# EAGLE design MaTouch Devkit_Strip Driver V1.1 (EAGLE 6.1)
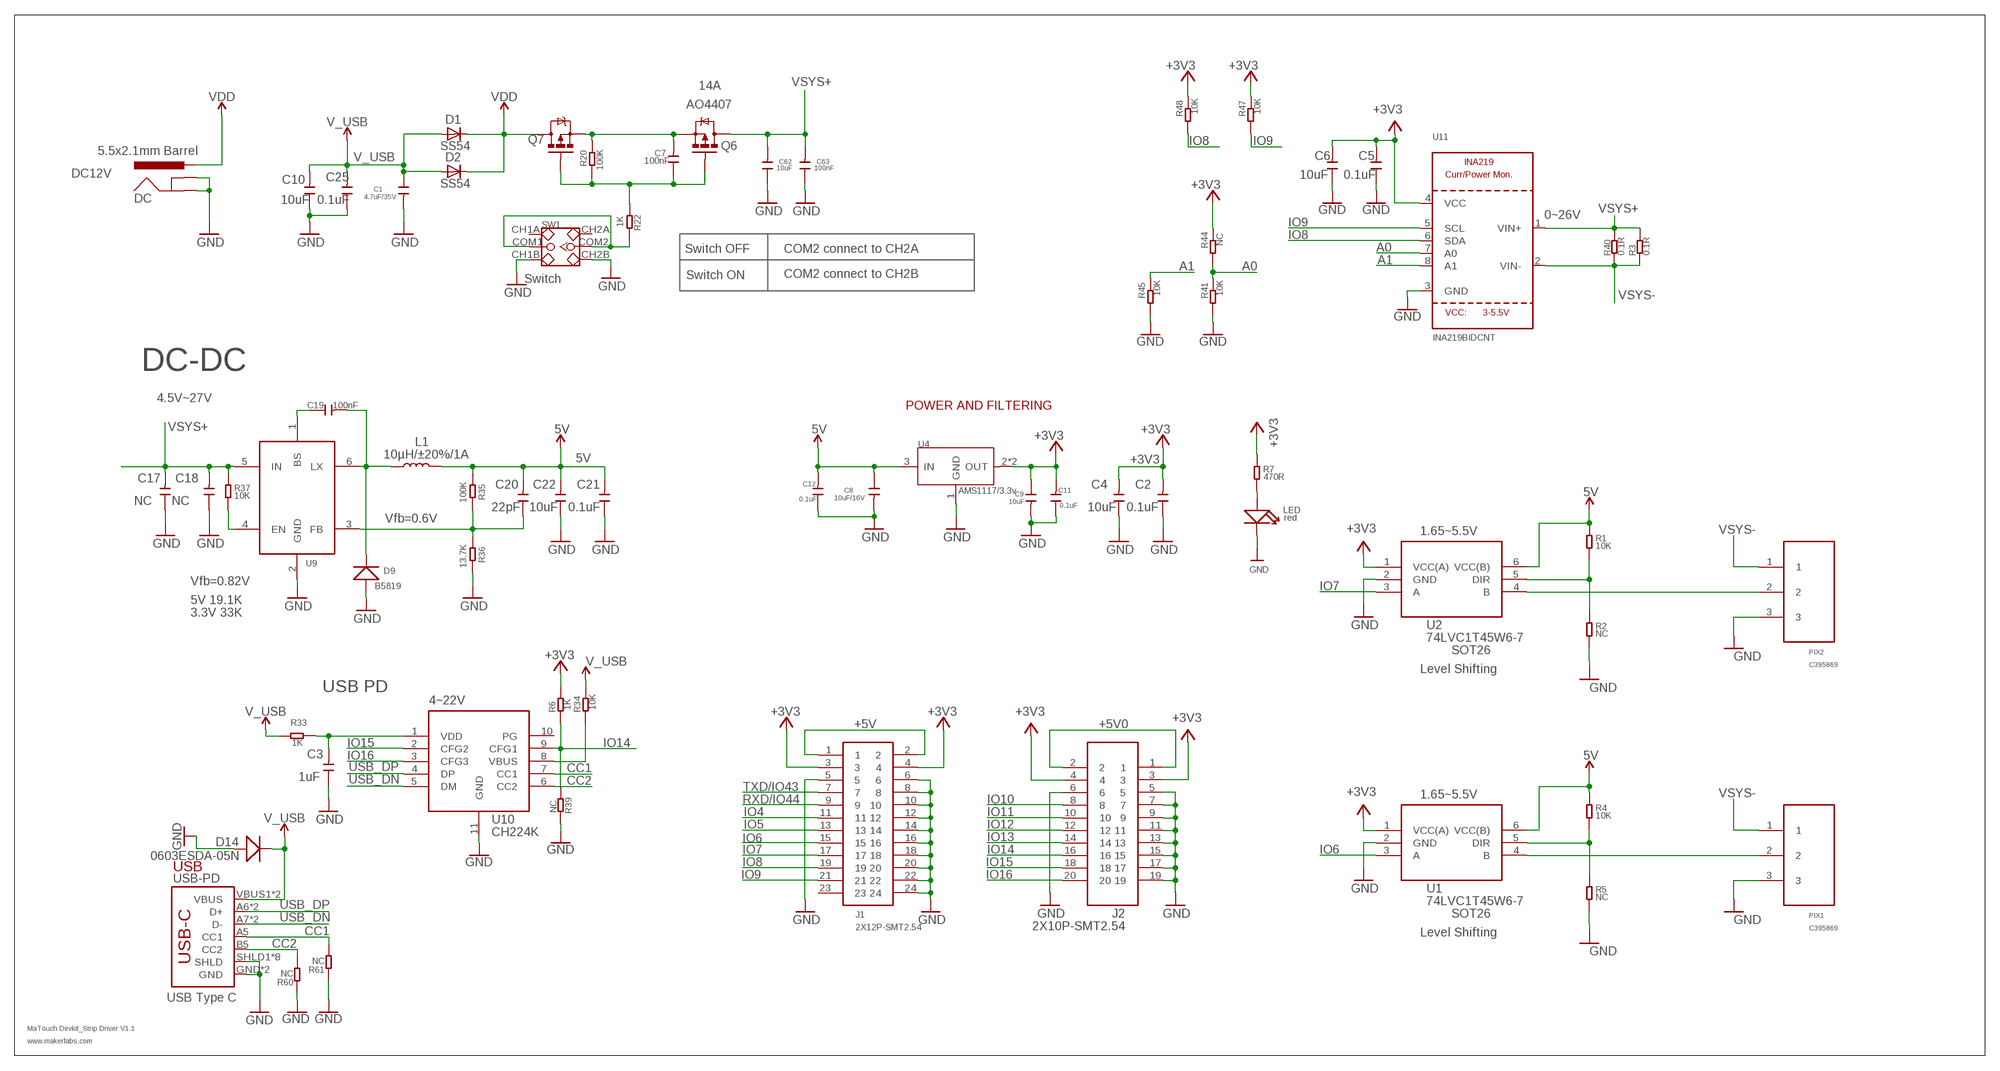
[diagram p0: schematic, sheet 1]

## Parts
C1  4.7uF/35V  C-0603  [0603]
C2  0.1uF  C-0603  [0603]
C3  1uF  C-0603  [0603]
C4  10uF  C-0603  [0603]
C5  0.1uF  C-0603  [0603]
C6  10uF  C-0603  [0603]
C7  100nF  C-0603  [0603]
C8  10uF/16V  C-0603  [0603]
C9  10uF  C-0603  [0603]
C10  10uF  C-0603  [0603]
C11  0.1uF  C-0603  [0603]
C12  0.1uF  C-0603  [0603]
C17  NC  C-0603  [0603]
C18  NC  C-0603  [0603]
C19  100nF  C-0603  [0603]
C20  22pF  C-0603  [0603]
C21  0.1uF  C-0603  [0603]
C22  10uF  C-0603  [0603]
C25  0.1uF  C-0603  [0603]
C62  10uF  C-0603  [0603]
C63  100nF  C-0603  [0603]
D1  SS54  DIODE-DO-214AC  [DO-214AC]
D2  SS54  DIODE-DO-214AC  [DO-214AC]
D9  B5819  D'1206'  [SOD123]
D14  0603ESDA-05N  DISCRETE_D0603  [DISCRETE_SOD523]
DC  5.5x2.1mm Barrel  POWER_JACKSMD  [POWER_JACK_SMD]
J1  2X12P-SMT2.54  [2X12P-SMT2.54]
J2  2X10P-SMT2.54  [2X10P-SMT2.54]
L1  10µH/±20%/1A  INDUCTOR-SRN6045-33UH  [SRN6045]
LED  red  DISCRETE_LED0603  [DISCRETE_LED-0603]
PIX1  C395869  [PIN_3P]
PIX2  C395869  [PIN_3P]
Q6  MOSFET-PCHANNELFDS6675  [SO08]
Q7  MOSFET-PCHANNELFDS6675  [SO08]
R1  10K  R-0603  [R0603]
R2  NC  R-0603  [R0603]
R3  0.1R  DISCRETE_R-2512  [DISCRETE_R2512]
R4  10K  R-0603  [R0603]
R5  NC  R-0603  [R0603]
R6  1K  R-0603  [R0603]
R7  470R  R-0603  [R0603]
R20  100K  R-0603  [R0603]
R22  1K  R-0603  [R0603]
R33  1K  R-0603  [R0603]
R34  10K  R-0603  [R0603]
R35  100K  R-0603  [R0603]
R36  13.7K  R-0603  [R0603]
R37  10K  R-0603  [R0603]
R39  NC  R-0603  [R0603]
R40  0.1R  DISCRETE_R-2512  [DISCRETE_R2512]
R41  10K  R-0603  [R0603]
R44  NC  R-0603  [R0603]
R45  10K  R-0603  [R0603]
R47  10K  R-0603  [R0603]
R48  10K  R-0603  [R0603]
R60  NC  DISCRETE_R-0603  [DISCRETE_R0603]
R61  NC  DISCRETE_R-0603  [DISCRETE_R0603]
SW1  SWITCH-2CH-6P'90D'  [6P-2CH-2.54-9.0X3.6-90D]
U1  74LVC1T45W6-7  [SOT-23-6]
U2  74LVC1T45W6-7  [SOT-23-6]
U4  AMS1117/3.3v  LD1117'SOT89'  [SOT89]
U9  SY8201ABC  [SOT-23-6]
U10  CH224K  [ESSOP-10-150MIL]
U11  INA219BIDCNT  INA219  [SOT23-8]
USB-PD  USB_C5  [USB-C-16P-5]

## Nets
5V: C8.1 C12.2 C20.2 C21.2 C22.2 L1.2 R1.1 R4.1 R35.1 U1.6(VCC(B)) U2.6(VCC(B)) U4.3(IN)
+3V3: C2.2 C4.2 C5.2 C6.2 C9.1 C11.2 J1.3 J1.4 J2.3 J2.4 R6.2 R7.1 R44.2 R47.2 R48.2 U1.1(VCC(A)) U2.1(VCC(A)) U4.2(OUT) U4.4(OUT) U11.4(VCC)
+5V: J1.1 J1.2
+5V0: J2.1 J2.2
A0: R41.2 R44.1 U11.7(A0)
A1: R45.2 U11.8(A1)
CC1: R61.2 U10.7(CC1) USB-PD.A5(CC1)
CC2: R60.2 U10.6(CC2) USB-PD.B5(CC2)
GND: C1.2 C2.1 C3.1 C4.1 C5.1 C6.1 C8.2 C9.2 C10.1 C11.1 C12.1 C17.1 C18.1 C21.1 C22.1 C25.1 C62.1 C63.1 D9.+ D14.+ DC.GND(GNDBREAK) DC.P$4(GND) J1.5 J1.6 J1.8 J1.10 J1.12 J1.14 J1.16 J1.18 J1.20 J1.22 J1.24 J2.5 J2.6 J2.7 J2.9 J2.11 J2.13 J2.15 J2.17 J2.19 LED.- PIX1.3 PIX2.3 R2.2 R5.2 R36.2 R39.2 R41.1 R45.1 R60.1 R61.1 SW1.CH1B SW1.CH2B U1.2(GND) U2.2(GND) U4.1(GND) U9.2(GND) U10.11(GND) U11.3(GND) USB-PD.GND USB-PD.GND2(GND) USB-PD.SHLD1(SHLD) USB-PD.SHLD2(SHLD) USB-PD.SHLD3(SHLD) USB-PD.SHLD4(SHLD) USB-PD.SHLD5(SHLD) USB-PD.SHLD6(SHLD) USB-PD.SHLD7(SHLD) USB-PD.SHLD8(SHLD)
IO4: J1.11
IO5: J1.13
IO6: J1.15 U1.3(A)
IO7: J1.17 U2.3(A)
IO8: J1.19 R48.1 U11.6(SDA)
IO9: J1.21 R47.1 U11.5(SCL)
IO10: J2.8
IO11: J2.10
IO12: J2.12
IO13: J2.14
IO14: J2.16 R6.1 R39.1 U10.9(CFG1)
IO15: J2.18 U10.2(CFG2)
IO16: J2.20 U10.3(CFG3)
N$2: R4.2 R5.1 U1.5(DIR)
N$3: PIX2.2 U2.4(B)
N$4: PIX1.2 U1.4(B)
N$5: LED.+ R7.2
N$9: C7.1 Q6.4(G) Q7.4(G) R20.2 R22.2
N$10: R22.1 SW1.COM1 SW1.COM2
N$41: C19.2 D9.- L1.1 U9.6(LX)
N$42: C19.1 U9.1(BS)
N$43: C20.1 R35.2 R36.1 U9.3(FB)
N$44: R37.2 U9.4(EN)
N$45: C3.2 R33.2 U10.1(VDD)
N$48: R34.1 U10.8(VBUS)
N$49: C7.2 Q6.1(S) Q6.2(S) Q6.3(S) Q7.1(S) Q7.2(S) Q7.3(S) R20.1
N$72: R1.2 R2.1 U2.5(DIR)
RXD/IO44: J1.9
TXD/IO43: J1.7
USB_DN: U10.5(DM) USB-PD.A7(D-) USB-PD.B7(D-)
USB_DP: U10.4(DP) USB-PD.A6(D+) USB-PD.B6(D+)
V_USB: C1.1 C10.2 C25.2 D1.A D2.A D14.- R33.1 R34.2 USB-PD.VBUS1(VBUS) USB-PD.VBUS2(VBUS)
VDD: D1.C D2.C DC.VIN0(PWR) Q7.5(D) Q7.6(D) Q7.7(D) Q7.8(D)
VSYS+: C17.2 C18.2 C62.2 C63.2 Q6.5(D) Q6.6(D) Q6.7(D) Q6.8(D) R3.2 R37.1 R40.2 U9.5(IN) U11.1(VIN+)
VSYS-: PIX1.1 PIX2.1 R3.1 R40.1 U11.2(VIN-)
Unconnected: J1.23 SW1.CH1A SW1.CH2A U10.10(PG)

## Notes on the sheet
- 14A
- AO4407
- DC12V
- 0~26V
- Switch OFF | COM2 connect to CH2A
- Switch ON | COM2 connect to CH2B
- Switch
- DC-DC
- 4.5V~27V
- POWER AND FILTERING
- Vfb=0.6V
- 1.65~5.5V
- Vfb=0.82V
- 5V 19.1K
- 3.3V 33K
- SOT26
- Level Shifting
- USB PD
- 4~22V
- 1.65~5.5V
- USB
- SOT26
- Level Shifting
- USB Type C
- MaTouch Devkit_Strip Driver V1.1
- www.makerfabs.com

## Library data of the parts
C1-C12 C17-C22 C25 C62 C63 = Discrete:C*: Ceramic Capacitors
D1 D2 = diode:DIODE-: DIODE
D9 = Discrete:D*
D14 = L:DISCRETE_D*
DC = SparkFun-Connectors:POWER_JACK: Power Jack Connector This is the standard 5.5mm barrel jack for power. The PTH is the most common, proven, reliable, footprint. The Slot footprint only works if the mill layer is transmitted to the PCB fab house so be warned. Here are the connectors we sell at SparkFun: DC Barrel Power Jack/Connector <https://www.sparkfun.com/products/119> (PRT-00119) DC Barrel Power Jack/Connector (SMD) <https://www.sparkfun.com/products/12748> (PRT-12748) DC Barrel Jack Adapter - Breadboard Compatible <https://www.sparkfun.com/products/10811> (PRT-10811) It is used on this SparkFun product (and many, many others): SparkFun RedBoard - Programmed with Arduino <https://www.sparkfun.com/products/12757> (DEV-12757) Also, if you need a mating power supply or connector, please check these out: Wall Adapter Power Supply - 9VDC 650mA <https://www.sparkfun.com/products/298> (TOL-00298) DC Barrel Jack Adapter - Male <https://www.sparkfun.com/products/10287> (PRT-10287); PROD_ID: CONN-08106; SF_ID: PRT-12748
J1 = sale:2X12P-SMT2.54
J2 = sale:2X10P-SMT2.54
L1 = SparkFun-Coils:INDUCTOR: Inductors Resist changes in electrical current. Basically a coil of wire. SparkFun Products: SparkFun Load Cell Amplifier - HX711 <https://www.sparkfun.com/products/13879> IOIO-OTG - V2.2 <https://www.sparkfun.com/products/13613>; PROD_ID: NDUC-11627; VALUE: 33µH/±20%/1.4A
LED = A9G:DISCRETE_LED*
PIX1 PIX2 = 1mytest:C395869
Q6 Q7 = User-Submitted:MOSFET-PCHANNEL: Generic PMOSFET IRLML2244 - TRANS-11153 (SOT-23 -20V -4.3A) (1.Gate 2.Source 3.Drain) FQP27P06 - COM-10349 <http://www.sparkfun.com/products/10349> (TO-220 -60V -27A) (1.Gate 2.Source 3.Drain)
R1 R2 R4-R7 R20 R22 R33-R37 R39 R41 R44 R45 R47 R48 = Discrete:R*
R3 R40 R60 R61 = A9G:DISCRETE_R*
SW1 = Discrete:SWITCH-2CH-6P
U1 U2 = self:74LVC1T45W6-7
U4 = IC:LD1117: Low Drop Fixed And Adjustable Positive Voltage Regulators http://www.datasheetcatalog.org/datasheet/SGSThomsonMicroelectronics/mXuqtqv.pdf
U9 = self:SY8201ABC
U10 = sale:CH224K
U11 = microbuilder:INA219: INA219 - I2C Current/Power Monitor Voltage Range: 0-26V Accuracy: 0.5% Temperature: -40°C - 125°C
USB-PD = USBC:USB_C: USB Type C 16Pin Connector Super Speed pins not available on the 16-pin purely SMD connector so this part is best for USB 2.0 implementations. D1 and D2 are tied together enabling D+/- no matter which way the cable is plugged into the connector. The two channel configuration pins (CC1/2) are exposed. These are normally connected to ground via 5.1k resistors but can be reconfigured for high current/high power applications.

## Net classes
0 default: width 0.203 mm, drill 0.305 mm, clearance 0.152 mm

## Board
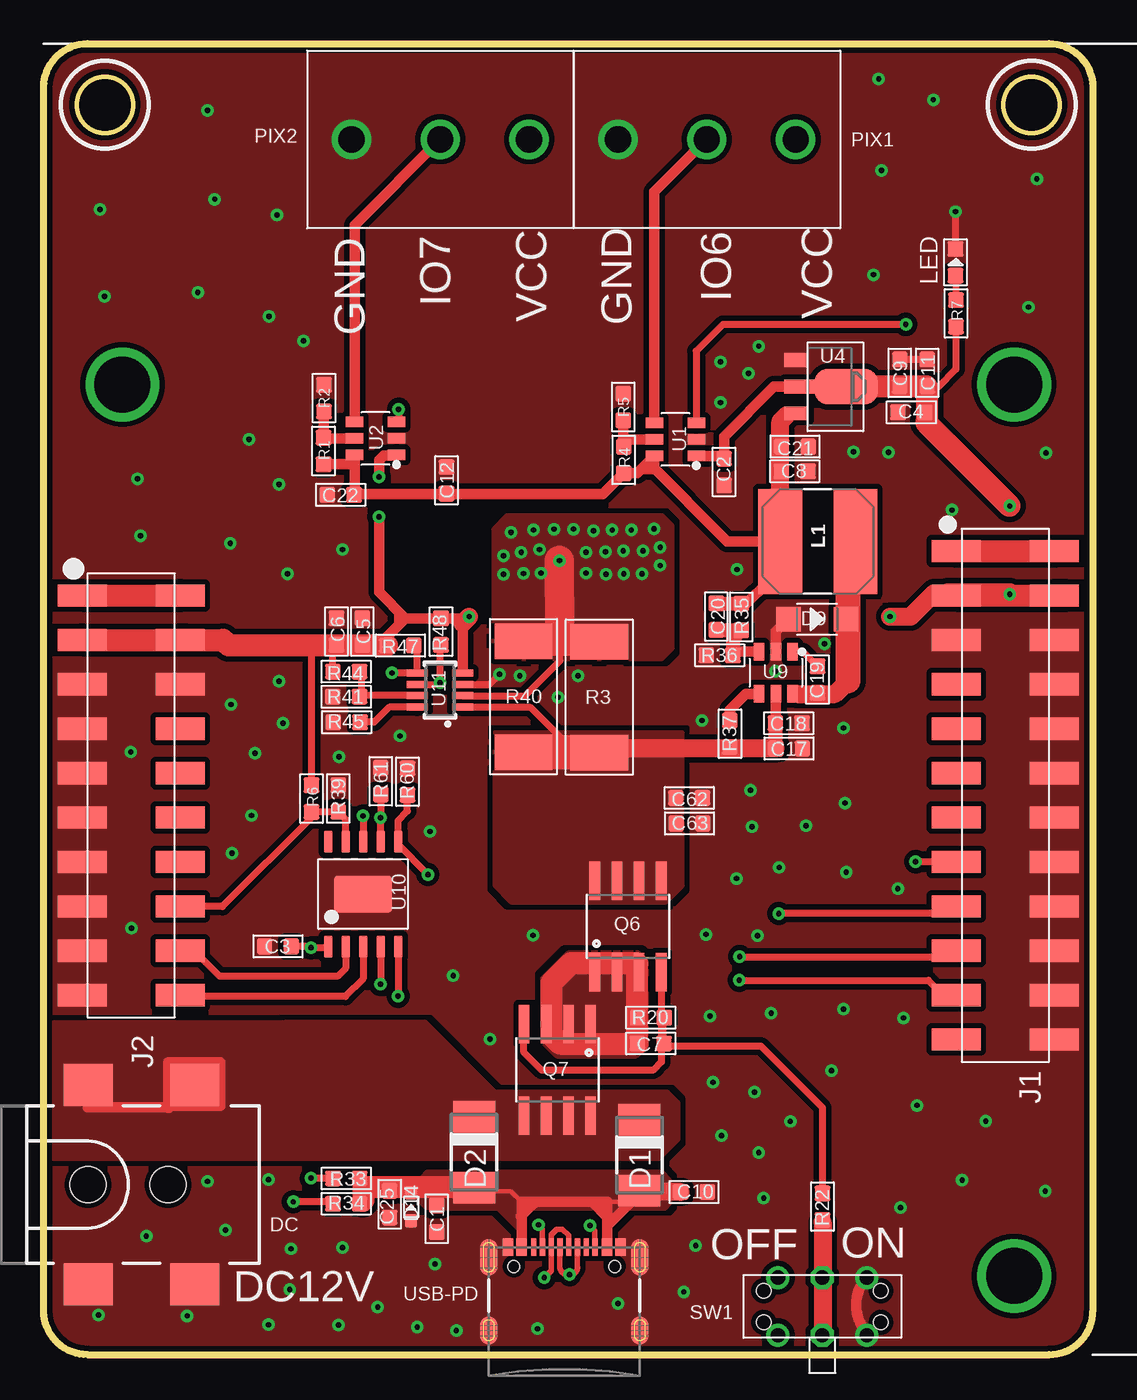
[diagram p1: board, top side]
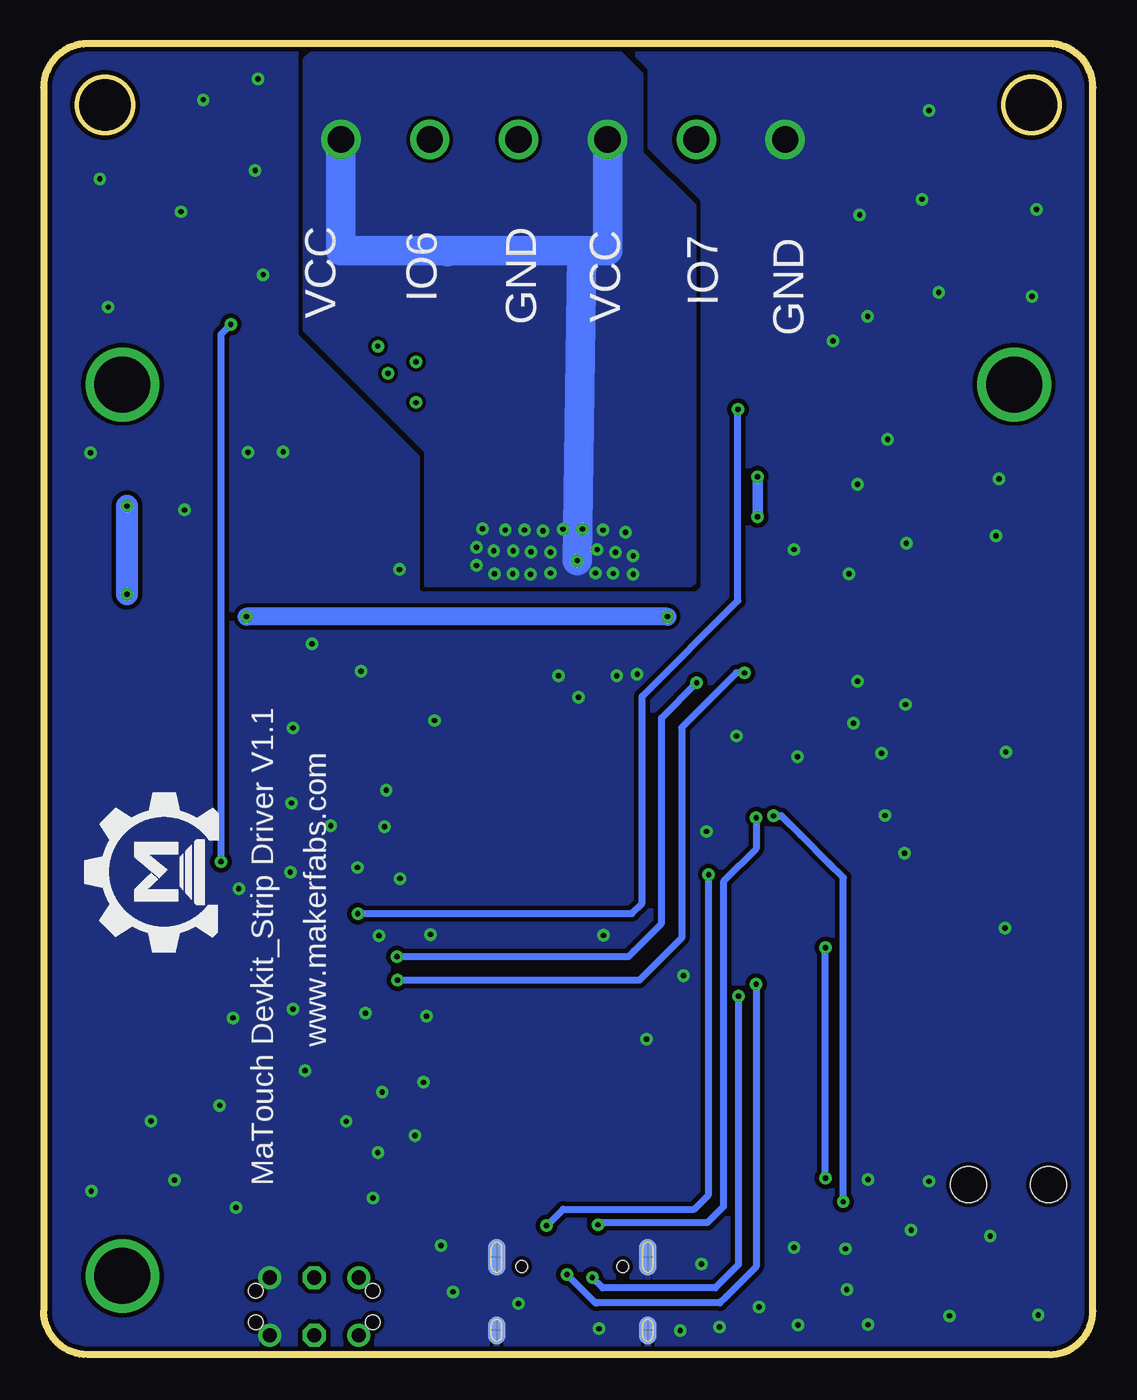
[diagram p2: board, bottom side, seen from below]

Size 60 x 75 mm. Coordinates in mm from the lower left corner, seen from the top.
Outline: 2.5,0 57.5,0 arc90 60,2.5 60,72.5 arc90 57.5,75 2.5,75 arc90 0,72.5 0,2.5 arc90 2.5,0
Outline: circle at 3.5,71.5 radius 1.6
Outline: circle at 56.5,71.5 radius 1.6
Copper layers (1*16): Top 0.035mm / dielectric 1.5mm / Bottom 0.035mm
Design rules: minimum track width 10mil, minimum drill 10mil, track to track 8mil, track to pad 8mil, pad to pad 8mil, via to via 8mil, smd to smd 0mil, copper to edge 10mil, drill to drill 8mil, minimum pad ring 10mil, minimum via ring 8mil, stop-mask expansion 4mil, vias tented up to drill 30mil, thermal gap 0mil
tRestrict: area 43.4,43.5 to 45.2,49.5

### Footprints (pad centres in the part's own frame; a part is rotated, then mirrored left to right if it is on the bottom)
0603 = smd 0.889 x 0.889: 1 -0.762,0; 2 0.762,0
DO-214AC = smd 1.8 x 2.4: A 2.025,0; C -2.025,0
SOD123 = smd 1.397 x 1.397: + -1.651,0; - 1.651,0
DISCRETE_SOD523 = smd 0.762 x 0.7: + -0.8,0; - 0.8,0
POWER_JACK_SMD = smd 2.8 x 2.4: GND 0,-5.7; P$4 6.1,-5.7; VIN0 0,5.7; VIN1 6.1,5.7 | hole 2.032: 0,0; 4.572,0
2X12P-SMT2.54 = smd 1.27 x 2.8: 1 -13.97,-2.8; 2 -13.97,2.8; 3 -11.43,-2.8; 4 -11.43,2.8; 5 -8.89,-2.8; 6 -8.89,2.8; 7 -6.35,-2.8; 8 -6.35,2.8; 9 -3.81,-2.8; 10 -3.81,2.8; 11 -1.27,-2.8; 12 -1.27,2.8; 13 1.27,-2.8; 14 1.27,2.8; 15 3.81,-2.8; 16 3.81,2.8; 17 6.35,-2.8; 18 6.35,2.8; 19 8.89,-2.8; 20 8.89,2.8; 21 11.43,-2.8; 22 11.43,2.8; 23 13.97,-2.8; 24 13.97,2.8
2X10P-SMT2.54 = smd 1.27 x 2.8: 1 -11.43,-2.8; 2 -11.43,2.8; 3 -8.89,-2.8; 4 -8.89,2.8; 5 -6.35,-2.8; 6 -6.35,2.8; 7 -3.81,-2.8; 8 -3.81,2.8; 9 -1.27,-2.8; 10 -1.27,2.8; 11 1.27,-2.8; 12 1.27,2.8; 13 3.81,-2.8; 14 3.81,2.8; 15 6.35,-2.8; 16 6.35,2.8; 17 8.89,-2.8; 18 8.89,2.8; 19 11.43,-2.8; 20 11.43,2.8
SRN6045 = smd 2.5 x 6: 1 -2.175,0; 2 2.125,0
DISCRETE_LED-0603 = smd 0.889 x 0.889: + -0.762,0; - 0.762,0
PIN_3P = drill 1.5: 1 0,10.16; 2 0,5.08; 3 0,0
SO08 = smd 0.61 x 2.21: 1 -1.905,-2.616; 2 -0.635,-2.616; 3 0.635,-2.616; 4 1.905,-2.616; 5 1.905,2.616; 6 0.635,2.616; 7 -0.635,2.616; 8 -1.905,2.616
R0603 = smd 0.889 x 0.889: 1 -0.762,0; 2 0.762,0
DISCRETE_R2512 = smd 2.032 x 3.302: 1 -3.175,0; 2 3.175,0
DISCRETE_R0603 = smd 0.889 x 0.889: 1 -0.762,0; 2 0.762,0
6P-2CH-2.54-9.0X3.6-90D = drill 0.813 pad 1.27: CH1A -2.54,-1.65; CH1B 2.54,-1.65; CH2A -2.54,1.65; CH2B 2.54,1.65 | drill 0.813 pad 1.27 octagon: COM1 0,-1.65; COM2 0,1.65 | hole 0.813: -3.35,0.9; -3.35,-0.9; 3.35,0.9; 3.35,-0.9
SOT-23-6 = smd 1 x 0.6: 1 -1.2,0.95; 2 -1.2,0; 3 -1.2,-0.95; 4 1.2,-0.95; 5 1.2,0; 6 1.2,0.95
SOT89 = smd 0.8 x 1.4: 1 -1.524,-1.905; 3 1.524,-1.905 | smd 0.8 x 1.9: 2 0,-1.651 | smd 2.032 x 3.65: 4 0,0.94
ESSOP-10-150MIL = smd 1.27 x 0.5: 1 -3,2; 2 -3,1; 3 -3,0; 4 -3,-1; 5 -3,-2; 6 3,-2; 7 3,-1; 8 3,0; 9 3,1; 10 3,2 | smd 2.1 x 3.3: 11 0,0
SOT23-8 = smd 0.4 x 1.2: 1 -0.975,-1.3; 2 -0.325,-1.3; 3 0.325,-1.3; 4 0.975,-1.3; 5 0.975,1.3; 6 0.325,1.3; 7 -0.325,1.3; 8 -0.975,1.3
USB-C-16P-5 = smd 0.3 x 1: A5 -1.25,-0.34; A6 -0.25,-0.34; A7 0.25,-0.34; A8 1.25,-0.34; B5 1.75,-0.34; B6 0.75,-0.34; B7 -0.75,-0.34; B8 -1.75,-0.34 | smd 0.6 x 1: GND -3.225,-0.34; GND2 3.225,-0.34; VBUS1 -2.45,-0.34; VBUS2 2.45,-0.34 | smd 1 x 2.1: SHLD1 -4.32,-0.915; SHLD2 4.32,-0.915 | smd 1 x 2.1 bottom: SHLD3 -4.32,-0.915; SHLD4 4.32,-0.915 | smd 1 x 1.6: SHLD5 -4.32,-5.095; SHLD8 4.32,-5.095 | smd 1 x 1.6 bottom: SHLD6 -4.32,-5.095; SHLD7 4.32,-5.095 | hole 0.65: -2.89,-1.445; 2.89,-1.445

### Placement (x,y rotation side)
C1  22.47,7.77 270 top
C2  38.91,50.5 90 top
C3  13.4,23.36 0 top
C4  49.62,53.91 0 top
C5  18.21,41.37 270 top
C6  16.74,41.37 270 top
C7  34.71,17.8 180 top
C8  42.95,50.53 0 top
C9  48.96,56.17 90 top
C10  37.19,9.31 180 top
C11  50.52,56.17 270 top
C12  23.04,50.02 270 top
C17  42.62,34.68 180 top
C18  42.6,36.13 180 top
C19  44.25,38.62 270 top
C20  38.46,42.23 90 top
C21  42.96,51.95 180 top
C22  16.98,49.19 0 top
C25  19.78,8.61 90 top
C62  36.91,31.85 180 top
C63  36.93,30.39 180 top
D1  34.06,11.42 270 top
D2  24.61,11.59 270 top
D9  44.24,42.07 0 top
D14  21.01,8.45 90 top
DC  2.54,9.73 0 top
J1  55,32 270 top
J2  5,32 270 top
L1  44.25,46.52 180 top
LED  52.15,62.5 90 top
PIX1  32.84,69.52 270 top
PIX2  17.6,69.52 270 top
Q6  33.41,24.5 0 top
Q7  29.37,16.29 180 top
R1  16,51.7 90 top
R2  16.03,54.72 90 top
R3  31.77,37.62 270 top
R4  33.17,51.19 90 top
R5  33.15,54.22 90 top
R6  15.32,31.81 90 top
R7  52.17,59.57 90 top
R20  34.73,19.28 0 top
R22  44.54,8.47 90 top
R33  17.31,10.08 180 top
R34  17.3,8.64 0 top
R35  39.89,42.2 270 top
R36  38.66,40.02 180 top
R37  39.24,35.52 90 top
R39  16.85,31.82 90 top
R40  27.44,37.64 270 top
R41  17.29,37.64 0 top
R44  17.3,39.08 180 top
R45  17.32,36.18 0 top
R47  20.4,40.58 180 top
R48  22.72,41.37 90 top
R60  20.8,32.78 270 top
R61  19.28,32.8 270 top
SW1  44.53,2.76 0 top
U1  36.12,52.36 180 top
U2  18.98,52.42 180 top
U4  44.96,55.38 270 top
U9  41.87,39.02 270 top
U10  18.26,26.35 90 top
U11  22.66,38.02 90 top
U$2  [MAKERFABS_0.3]  50.05,23.49 90 bottom
USB-PD  29.77,6.49 0 top

### Tracks (layer width: path | path; a pad name or v marks a point on that pad's centre or on a via)
5V
  Top 0.254: C12.2 23.06,49.26 23.09,49.29 23.09,49.22
  Top 0.406: 42.47,53.73 42.57,53.73 42.94,53.73 U4.3 43.07,53.85 43.08,53.86 | C8.1 42.19,51.93 42.22,51.95 C21.2 | 34.21,50.58 35.03,50.58 35.03,51.24 34.92,51.24 U1.6
  Top 0.61: C22.2 17.78,49.22 | 17.78,49.22 17.78,50.94 | 17.78,50.94 U2.6 | R1.1 17.78,50.94 | 34.56,51.05 33.94,50.43 R4.1 31.96,49.22 23.09,49.22 17.78,49.22 | 34.56,51.05 U1.6 | L1.2 41.43,46.52 | 41.43,46.52 39.09,46.52 34.56,51.05 | C21.2 42.2,53.36 42.57,53.73 | C20.2 40.21,42.99 41.4,44.18 41.4,46.49 41.43,46.52
  Top 0.813: C20.2 38.48,42.97 R35.1
  Top 1.016: L1.2 42.13,53.39 42.47,53.73
+3V3  (via drill 0.3)
  Top 0.406: 19.6,40.61 C6.2 16.54,40.4 R44.2 | 19.6,40.61 R47.2 | 19.6,40.61 C5.2 | U11.4 23.96,39.2 23.95,39.2 | R6.2 15.32,40.12 15.77,40.58 | R7.1 52.17,56.37 51.16,55.36 50.57,55.36 C11.2 | 20.22,41.59 20.22,42.45 20.55,42.12 20.68,42.12
  Top 0.61: R47.2 19.63,41.08 20.68,42.12 | 20.68,42.12 R48.2 | R48.2 23.67,42.12 23.96,41.84 23.96,41.8 23.95,41.79 23.95,39.2 | R48.2 22.79,42.13 22.81,42.15 | U1.1 38.76,51.41 C2.2 38.91,52.54 41.76,55.38 44.4,55.38 | 50.49,55.38 C11.2 | 44.4,55.38 44.58,55.38 | 44.58,55.38 45.06,55.38 | 45.06,55.38 44.58,55.38 | U4.2 44.39,55.38 44.4,55.38 | 45.06,55.38 U4.4 | C9.1 C11.2 | C11.2 50.52,53.43 50.49,53.4 50.49,53.8 C4.2 | 20.68,42.12 19.18,43.62 v19.18,47.94 | v19.18,50.23 19.18,51.17 19.46,51.45 20.19,51.45 arc253 U2.1
  Top 1.016: 23.96,41.84 23.96,41.85 v24.33,42.23 | v48.4,42.23 49.58,42.23 50.93,43.57 51.64,43.57 51.71,43.5 | 58.41,43.43 J1.4
  Top 1.27: J2.3 J2.4 | J2.4 8.07,40.89 8.08,40.88 | R47.2 15.77,40.58 10.57,40.58 10.29,40.85 10.25,40.89 J2.4 | v55.24,48.55 50.49,53.3 50.49,53.4 50.49,55.38 45.06,55.38 44.81,55.38 | v55.24,43.5 52.17,43.5 | 52.17,43.5 51.71,43.5 | 58.42,43.42 58.41,43.43 J1.4 J1.3 52.2,43.47 52.17,43.5 | 44.81,55.38 44.58,55.38 | 44.58,55.38 44.55,55.38 44.58,55.38 | 44.58,55.38 44.81,55.38
  Bottom 0.61: v19.18,47.94 v19.18,50.23
  Bottom 1.016: v24.33,42.23 v48.4,42.23
  Bottom 1.27: v55.24,48.55 v55.24,43.5
+5V
  Top 1.27: J1.1 J1.2
+5V0
  Top 0.61: 7.79,43.43 J2.2
  Top 1.27: J2.1 7.79,43.43 J2.2
A0
  Top 0.406: U11.7 18.29,37.7 18.21,37.78 18.21,37.76 18.19,37.73 | 18.19,37.73 18.19,38.87 18.01,39.05 18.03,39.05 R44.1 | R41.2 18.1,37.65 18.19,37.73
A1
  Top 0.406: U11.8 19.77,37.05 18.9,36.18 R45.2
CC1  (via drill 0.3)
  Top 0.305: 28.47,7.23 v28.3,7.43 28.3,7.4 28.52,7.17 USB-PD.A5
  Top 0.406: U10.7 19.26,30.71 v19.25,30.72 19.28,30.74 R61.2
  Bottom 0.406: v19.25,30.72 19.25,28.94 21.13,27.06 21.13,8.47 22.05,7.55 28.3,7.55 v28.3,7.43
CC2  (via drill 0.3)
  Top 0.305: USB-PD.B5 31.52,7.1 v31.24,7.38
  Top 0.406: v21.97,27.47 20.26,29.18 U10.6 20.26,30.56 20.8,31.1 R60.2
  Bottom 0.406: v31.24,7.38 30.3,8.32 22.81,8.32 21.97,9.16 v21.97,27.47
GND  (via drill 0.3)
  Top 0.406: C11.1 C9.2 | LED.- v52.15,65.39 | U11.3 25.49,38.35 v26.06,38.92 | v26.06,38.92 26.09,38.95 v26.06,38.92
  Top 0.61: U9.2 41.87,41.36 D9.+ | SW1.CH1B 46.71,1.82 arc-70 SW1.CH2B 47.04,4.38 47.12,4.43
  Top 1.016: 47.07,4.35 47.04,4.38 SW1.CH2B
  Bottom 0.406: v52.15,65.39 52.15,65.37
  other vias: 50.88,71.79 9.37,71.18 5.36,50.1 12.09,34.4 10.72,37.2 11.89,30.85 14.15,6.06 17.09,6.13 14.07,3.72 49,8.42 37.29,6.23 38.28,15.58 38.76,12.53 41.17,8.95 57.28,9.36 49.94,14.26 43.59,30.26 29.41,37.6 30.56,38.85 41.86,39.1 44.65,40.68 37.64,36.28 39.65,44.92 9.37,9.92 12.85,10.02 3.12,2.27 5.87,6.79 10.39,7.12 8.2,2.22 19.1,2.73 23.6,1.38 28.24,1.48 32.84,2.93 36.6,3.59 40.89,57.69 38.71,56.81 38.71,54.47 40.31,56.15 46.3,51.65 48.31,51.62 57.33,51.6 13.94,44.66 3.23,65.52 3.48,60.54 9.78,66.1 12.88,59.4 11.73,52.36 8.81,60.77 10.67,46.42 13.46,38.52 13.69,36.13 10.77,28.69 5.03,24.4 4.98,34.48 20.37,35.39 16.89,34.2 22.1,29.93 39.62,27.24 40.41,32.29 42.06,27.88 40.51,30.21 45.75,35.85 45.82,31.56 45.9,27.6 48.84,26.66 40.82,23.96 27.99,23.99 37.87,24.04 38.1,19.37 41.61,19.54 49.17,19.26 45.06,16.24 45.75,19.77 40.64,15.02 42.7,13.35 40.89,11.57 52.53,9.99 12.85,1.71 16.87,1.69 21.36,1.59 22.38,5.19 23.42,21.68 25.53,18.05 53.87,13.37 51.94,48.32 56.31,59.93 56.79,67.27 47.9,67.75 47.75,72.99 47.45,61.78 13.34,65.21 5.54,46.85 17.09,46.06 13.46,49.8 14.86,58 27.23,38.85
  pour Bottom (isolate 0.254, rank 4): -1.2,-15.8 -1.2,85 80,85 80,-15.8
  pour Top (isolate 0.305, rank 4, no thermals): -0.6,-15.8 -0.6,85 80,85 80,-15.8
IO6  (via drill 0.3)
  Top 0.406: J1.15 49.88,28.19 v49.86,28.2 | v49.3,58.94 38.84,58.94 37.31,57.42 U1.3 37.29,53.28 37.34,53.28
  Top 0.61: U1.3
  Bottom 0.406: v49.86,28.2 49.86,58.38 v49.3,58.94
IO7  (via drill 0.3)
  Top 0.406: J1.17 51.45,25.65 51.03,25.23 v42.04,25.23 | v20.3,54.09 20.3,53.49 U2.3
  Bottom 0.406: v42.04,25.23 26.36,25.23 25.78,25.82 25.78,37.65 20.3,43.14 v20.3,54.09
IO8  (via drill 0.3)
  Top 0.406: U11.6 22.57,38.35 v22.66,38.44 | v22.66,38.44 22.68,38.47 | 22.68,38.47 22.68,40.57 R48.1 | v22.66,38.44 22.66,38.47 22.68,38.47 | v39.8,22.77 51.94,22.77 arc90 52.22,23.05 arc-90 52.2,23.07 J1.19
  Bottom 0.406: v22.66,38.44 24.66,36.44 24.66,24.67 26.24,23.1 26.57,22.77 v39.8,22.77
IO9  (via drill 0.3)
  Top 0.406: R47.1 21.36,40.37 U11.5 v19.91,39 | v19.91,39 | v39.78,21.42 50.6,21.42 51.46,20.56 J1.21
  Bottom 0.406: v19.91,39 20.4,39 23.52,35.88 23.52,23.84 25.6,21.75 25.93,21.42 v39.78,21.42
IO14
  Top 0.406: J2.16 10.21,25.64 15.32,30.74 R6.1 | U10.9 17.26,30.63 R39.1 16.87,31.05 15.82,31.05 | 15.82,31.05 15.54,31.05 | 15.54,31.05 15.37,31.05 R6.1 | R6.1 15.54,31.05 | R39.1 15.83,31.06 15.82,31.05
IO15
  Top 0.406: U10.2 17.26,22.1 16.82,21.65 10.06,21.65 8.59,23.12 7.82,23.12 J2.18
IO16
  Top 0.406: U10.3 18.26,21.5 17.25,20.48 7.82,20.48 7.77,20.53 J2.20
N$2
  Top 0.61: R5.1 33.15,52.46 | 33.15,52.46 33.15,51.98 R4.2 | U1.5 33.25,52.36 arc-90 33.15,52.46
N$3
  Top 0.61: U2.4 arc-90 U2.4 17.77,64.62 PIX2.2
N$4
  Top 0.61: U1.4 34.92,66.52 PIX1.2
N$5
  Top 0.406: LED.+ 52.15,60.36 R7.2
N$6  (via drill 3.2)
  other vias: 55.5,4.5
N$7  (via drill 3.2)
  other vias: 55.5,55.5
N$8  (via drill 3.2)
  other vias: 4.5,55.5
N$9
  Top 0.406: Q6.4 35.32,17.96 | 35.32,17.96 C7.1 | C7.1 35.48,17.9 35.36,18.02 35.36,17.87 35.41,17.82 35.41,17.92 35.38,17.94 35.38,17.92 35.43,17.87 35.43,19.22 R20.2 | 35.32,17.96 35.32,16.74 34.85,16.27 28.47,16.27 27.46,17.28 27.46,18.78 27.48,18.81 27.47,18.82 Q7.4 | R22.2 44.54,14.12 41.02,17.64 35.59,17.64 35.51,17.72 35.51,17.77 C7.1
N$10
  Top 0.406: R22.1 44.54,7.59 44.55,7.58 44.55,7.45 44.5,7.4 44.5,7.02 44.45,6.97 44.45,1.26 44.53,1.18 44.53,1.36 44.5,1.38 44.5,4.38 SW1.COM2
  Top 1.016: 44.55,7.58 44.55,0.98 44.58,0.95 44.58,1.06 SW1.COM1
N$41
  Top 0.61: U9.6 43.05,37.82 43.05,37.81 | 45.29,37.83 45.29,37.86 C19.2 | 46,38.54 46,42.07 D9.-
  Top 1.016: 43.05,37.81 44.25,37.81 45.26,37.81 45.29,37.83 | 45.29,37.83 46,38.54 45.29,37.83
  Top 1.422: 46,38.54 46,46.09 46.38,46.47 L1.1
N$42
  Top 0.406: C19.1 43.41,40.22 42.85,40.22
  Top 0.61: U9.1 42.85,40.22
N$43
  Top 0.61: U9.3 39.62,40.22 R36.1
  Top 0.813: C20.1 39.87,41.46 R35.2 39.42,40.97 R36.1
N$44
  Top 0.61: R37.2 39.24,36.89 40.16,37.81 40.92,37.81 40.92,37.83 U9.4
N$45  (via drill 0.3)
  Top 0.406: R33.2 16.53,10.09 v15.29,10.09 | C3.2 15.29,23.36 v15.29,23.28 16.26,23.28 U10.1
  Bottom 0.406: v15.29,10.09 v15.29,23.28
N$48  (via drill 0.3)
  Top 0.406: R34.1 16.66,8.76 16.66,8.75 14.99,8.75 v14.28,8.75 | v18.26,30.82 18.26,29.48 | 18.26,29.48 18.26,29.37 | 18.26,29.37 U10.8 | U10.8 18.26,29.27 18.29,29.27 18.29,29.37 18.26,29.37 | U10.8 18.26,29.48
  Bottom 0.406: 16.66,29.68 16.71,29.73 | 16.71,29.73 17.8,30.82 v18.26,30.82 | 14.96,27.98 15.1,28.12 | 15.1,28.12 16.66,29.68 | 16.66,29.68 16.71,29.73 | 16.71,29.73 16.66,29.68 | 16.66,29.68 17.78,30.8 18.26,30.8 | v14.28,8.75 14.28,27.29 15.1,28.12
N$49
  Top 1.27: C7.2 33.95,22.37 33.93,22.39 30.15,22.39 29.03,21.27 29.03,18.3 29.06,18.27 29.54,17.79 33.93,17.79 33.96,17.82 33.96,17.87
  pour Top: 29.34,17.16 33.88,17.16 34.42,17.69 34.42,22.52 34.01,22.92 30,22.92 28.57,21.5 28.57,17.92
N$72
  Top 0.61: U2.5 16.05,52.42 arc-90 R1.2 16,53.94 arc-90 R2.1
USB_DN  (via drill 0.3)
  Top 0.305: USB-PD.A7 30.02,6.82 29.67,7.17 29.34,7.17 29.02,6.86 USB-PD.B7 29.02,5.91 29.03,5.9 29.03,4.81 v28.63,4.41
  Top 0.406: U10.5 v20.26,20.52 arc90 v20.27,20.51
  Bottom 0.406: v20.27,20.51 20.27,5.14 21.59,3.82 28.04,3.82 v28.63,4.41
USB_DP  (via drill 0.3)
  Top 0.254: 30.07,4.56 30.1,4.53 v30.07,4.58 30.05,4.58 30.15,4.58 arc90 30.53,4.96
  Top 0.305: USB-PD.A6 29.52,5.07 arc169 30.53,4.96 30.52,4.96 USB-PD.B6
  Top 0.406: U10.4 19.26,21.2 v19.25,21.2 | v30.07,4.58 30.05,4.56 30.07,4.56 | 30.07,4.56 30.1,4.58 30.07,4.56
  Bottom 0.406: v19.25,21.2 19.25,5.04 20.98,3.31 21.34,2.96 28.37,2.96 28.45,2.96 28.8,3.31 v30.07,4.58
V_USB
  Top 0.254: R33.1 18.07,9.32 18.29,9.11 | 18.24,8.8 R34.2 18.07,8.7 18.69,9.33 19.75,9.33 C25.2 19.8,9.37 19.81,9.36 19.84,9.36 26.72,9.36 27.33,8.75 | 18.29,8.88 18.69,9.28 20.32,9.28 20.34,9.26 D14.- 22.35,9.25 22.43,9.18 22.43,8.58 C1.1 | 32.23,8.75 33.45,8.75 | 33.45,8.75 34.09,9.38 34.08,9.39 D1.A | 32.33,7.48 32.16,7.48 32.16,7.94 | 33.45,8.75 33.68,8.75 33.68,8.85 33.71,8.85
  Top 0.61: USB-PD.VBUS2 32.23,6.16 32.23,8.67 | USB-PD.VBUS1 27.33,8.75 32.23,8.75 32.23,8.7 | 32.23,8.7 32.23,8.67 | 32.23,8.67 32.23,8.7 | 32.33,7.48 33.71,8.85 | 27.28,7.91 28.02,8.65 28.04,8.65 | 32.16,7.94 31.45,8.65
  Top 1.016: C10.2 34.16,9.31 34.09,9.38
  Top 1.27: D2.A 18.33,9.57 18.29,9.61 18.29,9.11 18.29,8.88 18.29,8.85 18.24,8.8
  pour Top: 21.95,10.45 35.33,10.45 35.81,9.97 35.81,8.65 35.53,8.37 21.89,8.37 21.62,8.65 21.62,10.12
  pour Top: 32.21,7.12 34.14,9.05 32.21,9.05
  pour Top: 27.38,7.02 27.38,9.28 25.04,9.28 27.3,7.02
VDD
  Top 0.61: 7.39,14.23 10.08,14.23 10.08,16.73 7.11,16.73 7.11,14.13 7.16,14.13 7.16,14.16 2.52,14.16 2.52,15.43 DC.VIN0 | DC.VIN0 2.49,15.43 | 2.49,15.43 2.49,15.45 2.49,15.43 | DC.VIN0 | DC.VIN0 2.49,15.43
  pour Top: 15,19 0.58,19 0.58,11.2 15,11.2
  pour Top: 13.82,11.21 35.18,11.21 36.3,12.33 36.3,14.41 35.66,15.05 25.81,15.05 21.82,19.04 13.82,19.04
VSYS+
  Top 0.406: U11.1 27.51,37.05 27.81,37.05 29.62,35.24 28.21,35.24 R40.2 | C17.2 39.27,34.68 39.19,34.76 R37.1
  Top 0.61: U9.5 41.87,36.12 | 41.87,36.12 41.86,36.1 | 41.86,36.11 C18.2 | 41.86,36.08 C18.2 | 41.87,36.12 C18.2
  Top 0.813: C17.2 41.86,36.08 41.81,36.13
  Top 1.016: C17.2 32.01,34.68 R3.2
  Top 1.93: R3.2 27.46,34.44 R40.2
  pour Top: 25.78,35.6 25.78,26.83 26.75,25.87 35.59,25.87 36.53,26.81 36.53,35.6
VSYS-  (via drill 0.3)
  Top 0.406: U11.2 23.96,37.68 25.83,37.68 27.51,37.68 29.52,39.69 29.52,41.31 | 29.69,40.88 29.67,40.85 29.67,40.82
  Top 1.676: R40.1 29.67,40.82 31.77,40.82 R3.1 31.77,40.83 29.62,40.83 | v29.49,45.43 29.52,41.31 29.52,41.06 29.69,40.88 29.72,40.88
  Bottom 1.676: PIX2.1 27.76,63.16 29.69,63.16 | 29.69,63.16 35.71,63.16 | 35.71,63.16 39.73,63.16 | 39.73,63.16 41.1,63.16 | 41.1,63.16 43,63.16 43,69.48 42.98,69.48 | 35.61,63.16 35.71,63.16 | 40.87,63.16 41.1,63.16 | 36.93,63.11 36.88,63.11 36.88,63.16 39.73,63.16 | v29.49,45.43 29.23,62.93 29.36,62.93 29.36,63.16 29.69,63.16
  other vias: 26.72,47.05 26.29,44.64 26.29,45.71 31.45,47.13 32.51,47.18 33.6,47.18 34.9,47.26 35.26,46.19 35.26,45.15 34.21,44.66 33.17,44.66 32.16,44.64 31.01,44.72 27.43,44.69 28.35,46.06 28.02,47.18 29.18,47.23 30.3,47.23 31.01,45.91 32.13,45.93 33.15,45.99 34.26,45.99 27.3,45.91 28.45,44.72
  pour Top: 25.83,39.79 35.33,39.79 35.94,40.4 35.94,47.43 35.38,47.99 26.49,47.99 25.73,47.23 25.73,39.89
  pour Bottom: 22.99,44.03 38.13,44.03 38.13,51.7 45.06,58.63 45.06,74.08 44.48,74.66 27.23,74.66 25.83,73.27 25.83,68.74 22.81,65.72 22.81,44.21

### Text on the board
tPlace: VCC | GND | IO7 | VCC | GND | IO6 | OFF | ON | DC12V
bPlace: GND | VCC | GND | IO7 | VCC | IO6 | www.makerfabs.com | MaTouch Devkit_Strip Driver V1.1